# Altium schematic sheet TopSheet.SchDoc
size A4; SheetNumber: 1; SheetTotal: 7
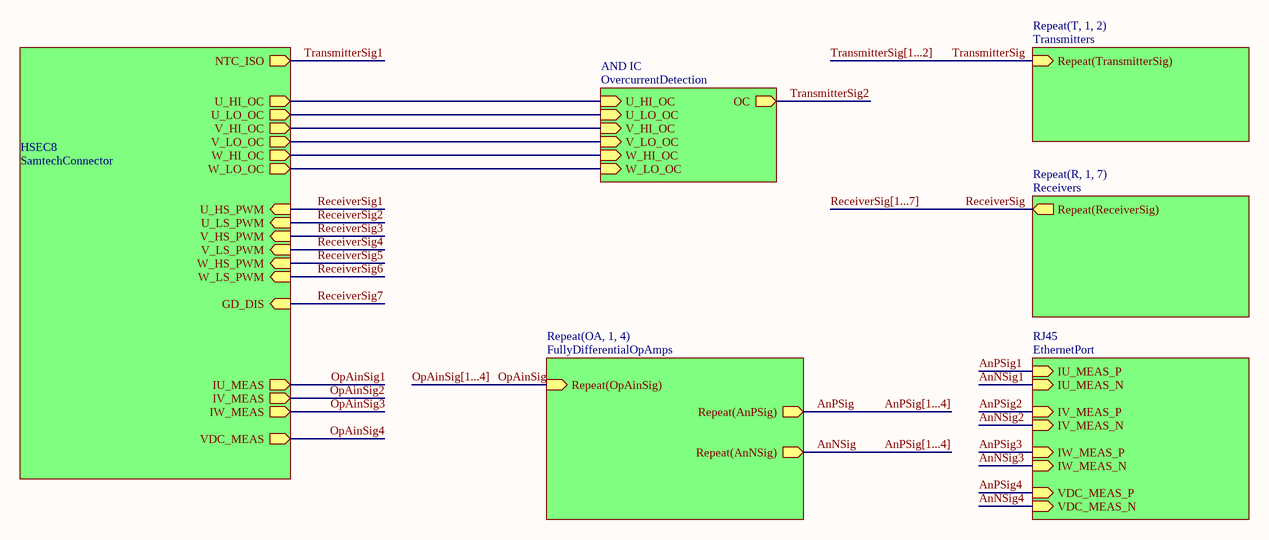
[diagram p0: TopSheet.SchDoc]

## Sub-sheets
AND IC = OvercurrentDetection: U_HI_OC (in), U_LO_OC (in), V_HI_OC (in), V_LO_OC (in), W_HI_OC (in), OC (out), W_LO_OC (in)
HSEC8 = SamtechConnector: NTC_ISO (out), U_HI_OC (out), U_LO_OC (out), V_HI_OC (out), V_LO_OC (out), W_HI_OC (out), W_LO_OC (out), IU_MEAS (out), U_HS_PWM (in), U_LS_PWM (in), V_HS_PWM (in), V_LS_PWM (in), W_HS_PWM (in), W_LS_PWM (in), GD_DIS (in), IV_MEAS (out), IW_MEAS (out), VDC_MEAS (out)
Repeat(OA, 1, 4) = FullyDifferentialOpAmps: Repeat(OpAinSig) (in), Repeat(AnPSig) (out), Repeat(AnNSig) (out)
Repeat(R, 1, 7) = Receivers: Repeat(ReceiverSig) (out)
Repeat(T, 1, 2) = Transmitters: Repeat(TransmitterSig) (in)
RJ45 = EthernetPort: IU_MEAS_P (in), IU_MEAS_N (in), IV_MEAS_P (in), IV_MEAS_N (in), IW_MEAS_P (in), IW_MEAS_N (in), VDC_MEAS_P (in), VDC_MEAS_N (in)

## Nets
AnNSig: sheet Repeat(OA, 1, 4)/Repeat(AnNSig)  [also labelled AnPSig[1...4]]
AnNSig1: sheet RJ45/IU_MEAS_N
AnNSig2: sheet RJ45/IV_MEAS_N
AnNSig3: sheet RJ45/IW_MEAS_N
AnNSig4: sheet RJ45/VDC_MEAS_N
AnPSig: sheet Repeat(OA, 1, 4)/Repeat(AnPSig)
AnPSig1: sheet RJ45/IU_MEAS_P
AnPSig2: sheet RJ45/IV_MEAS_P
AnPSig3: sheet RJ45/IW_MEAS_P
AnPSig4: sheet RJ45/VDC_MEAS_P
OpAinSig: sheet Repeat(OA, 1, 4)/Repeat(OpAinSig)
OpAinSig1: sheet HSEC8/IU_MEAS
OpAinSig2: sheet HSEC8/IV_MEAS
OpAinSig3: sheet HSEC8/IW_MEAS
OpAinSig4: sheet HSEC8/VDC_MEAS
ReceiverSig: sheet Repeat(R, 1, 7)/Repeat(ReceiverSig)
ReceiverSig1: sheet HSEC8/U_HS_PWM
ReceiverSig2: sheet HSEC8/U_LS_PWM
ReceiverSig3: sheet HSEC8/V_HS_PWM
ReceiverSig4: sheet HSEC8/V_LS_PWM
ReceiverSig5: sheet HSEC8/W_HS_PWM
ReceiverSig6: sheet HSEC8/W_LS_PWM
ReceiverSig7: sheet HSEC8/GD_DIS
TransmitterSig: sheet Repeat(T, 1, 2)/Repeat(TransmitterSig)
TransmitterSig1: sheet HSEC8/NTC_ISO
TransmitterSig2: sheet AND IC/OC
(unnamed): sheet HSEC8/U_HI_OC, sheet AND IC/U_HI_OC
(unnamed): sheet HSEC8/U_LO_OC, sheet AND IC/U_LO_OC
(unnamed): sheet HSEC8/V_HI_OC, sheet AND IC/V_HI_OC
(unnamed): sheet HSEC8/V_LO_OC, sheet AND IC/V_LO_OC
(unnamed): sheet HSEC8/W_HI_OC, sheet AND IC/W_HI_OC
(unnamed): sheet HSEC8/W_LO_OC, sheet AND IC/W_LO_OC

## Buses and harness runs
bus AnPSig[1...4]
bus OpAinSig[1...4]
bus ReceiverSig[1...7]
bus TransmitterSig[1...2]